# EAGLE board PulseRain_M10 (EAGLE 7.7.0)
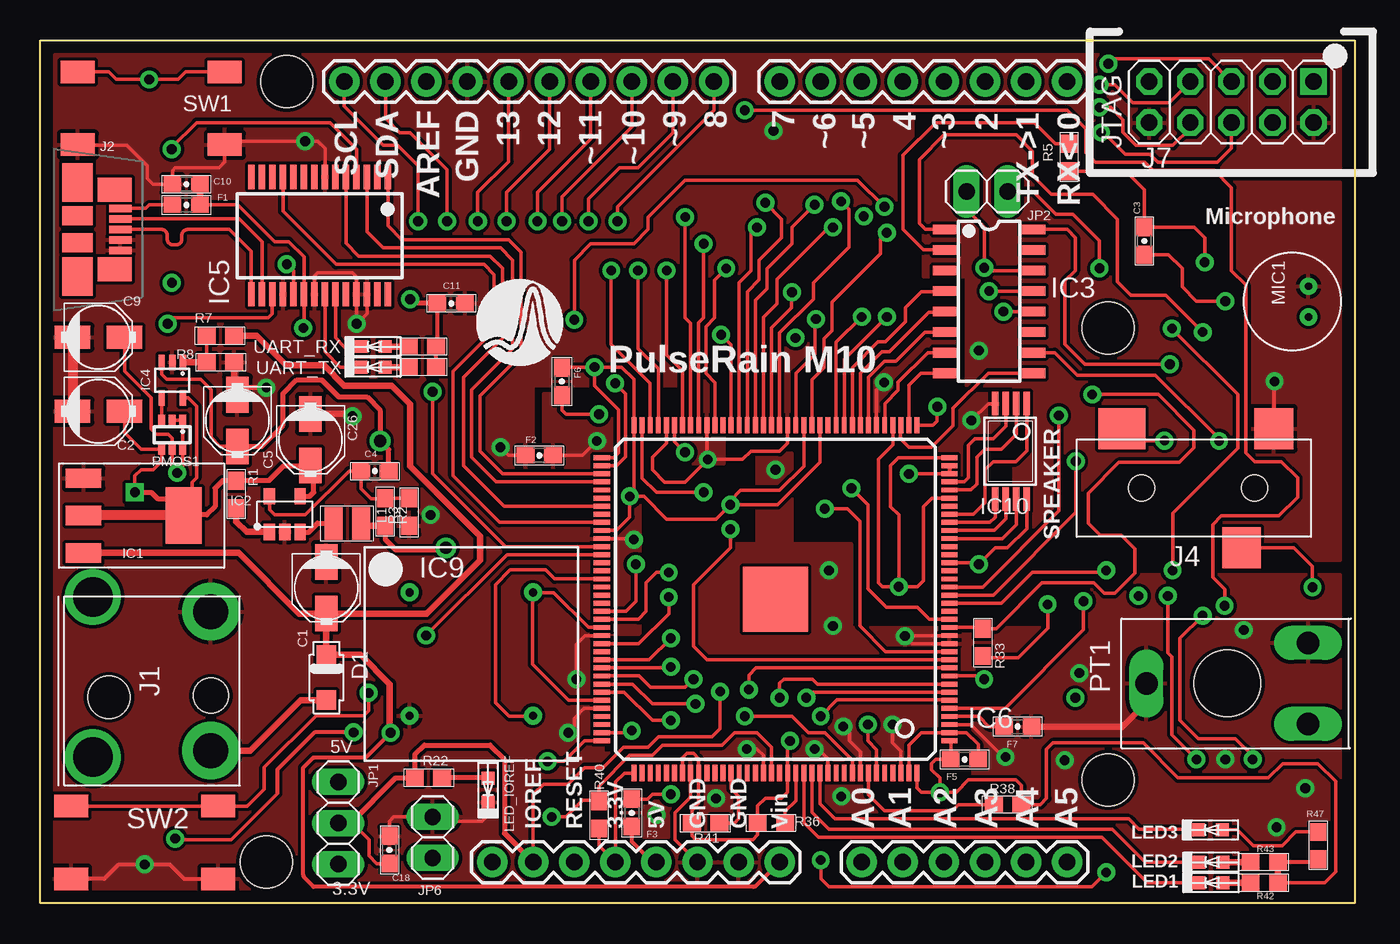
[diagram p14: board, top side]
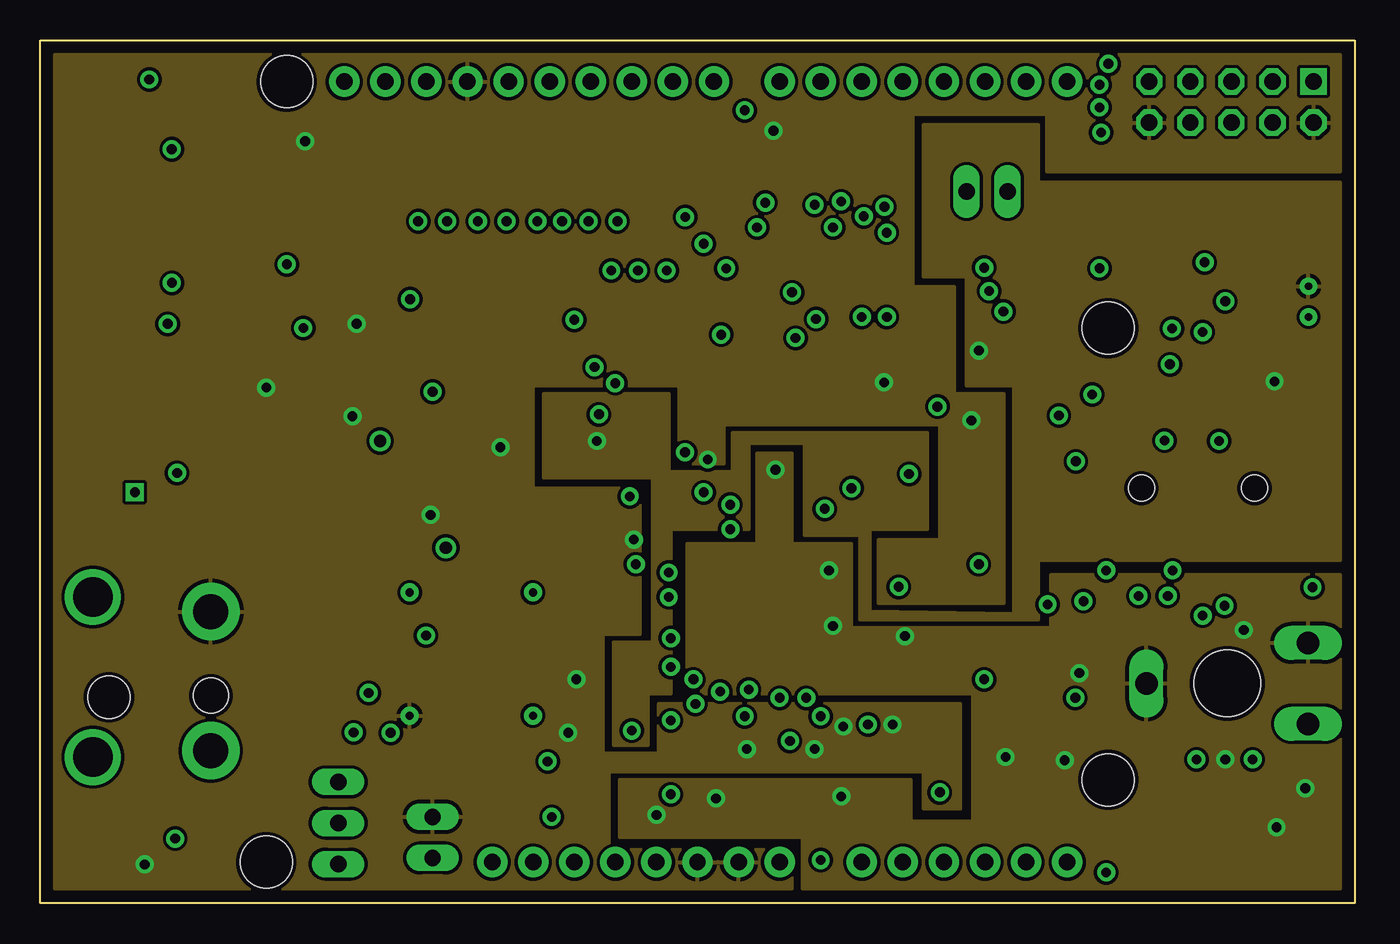
[diagram p15: board, inner layer Ground]
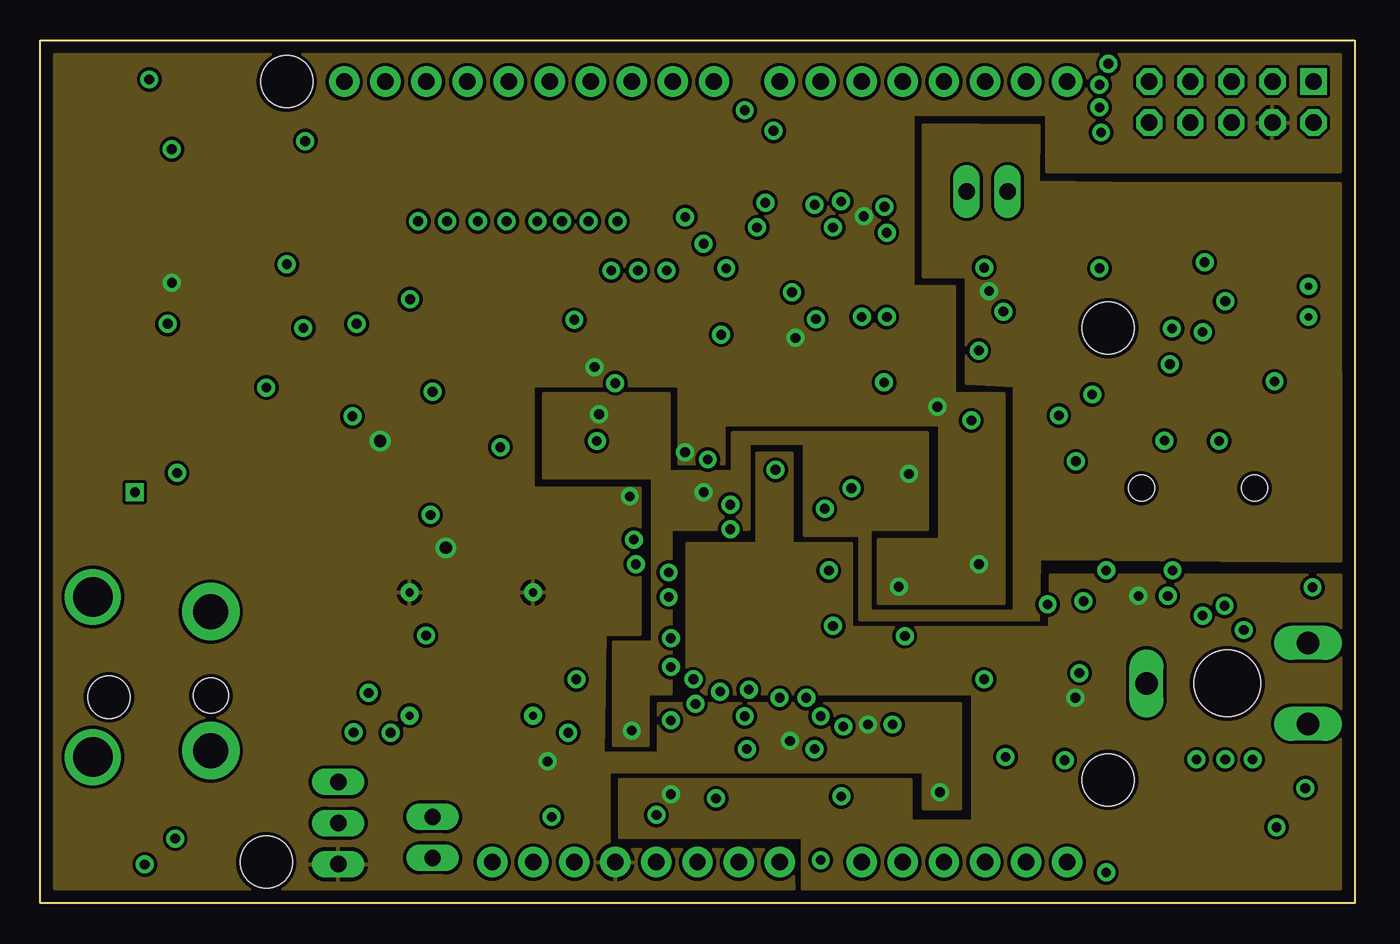
[diagram p16: board, inner layer Power]
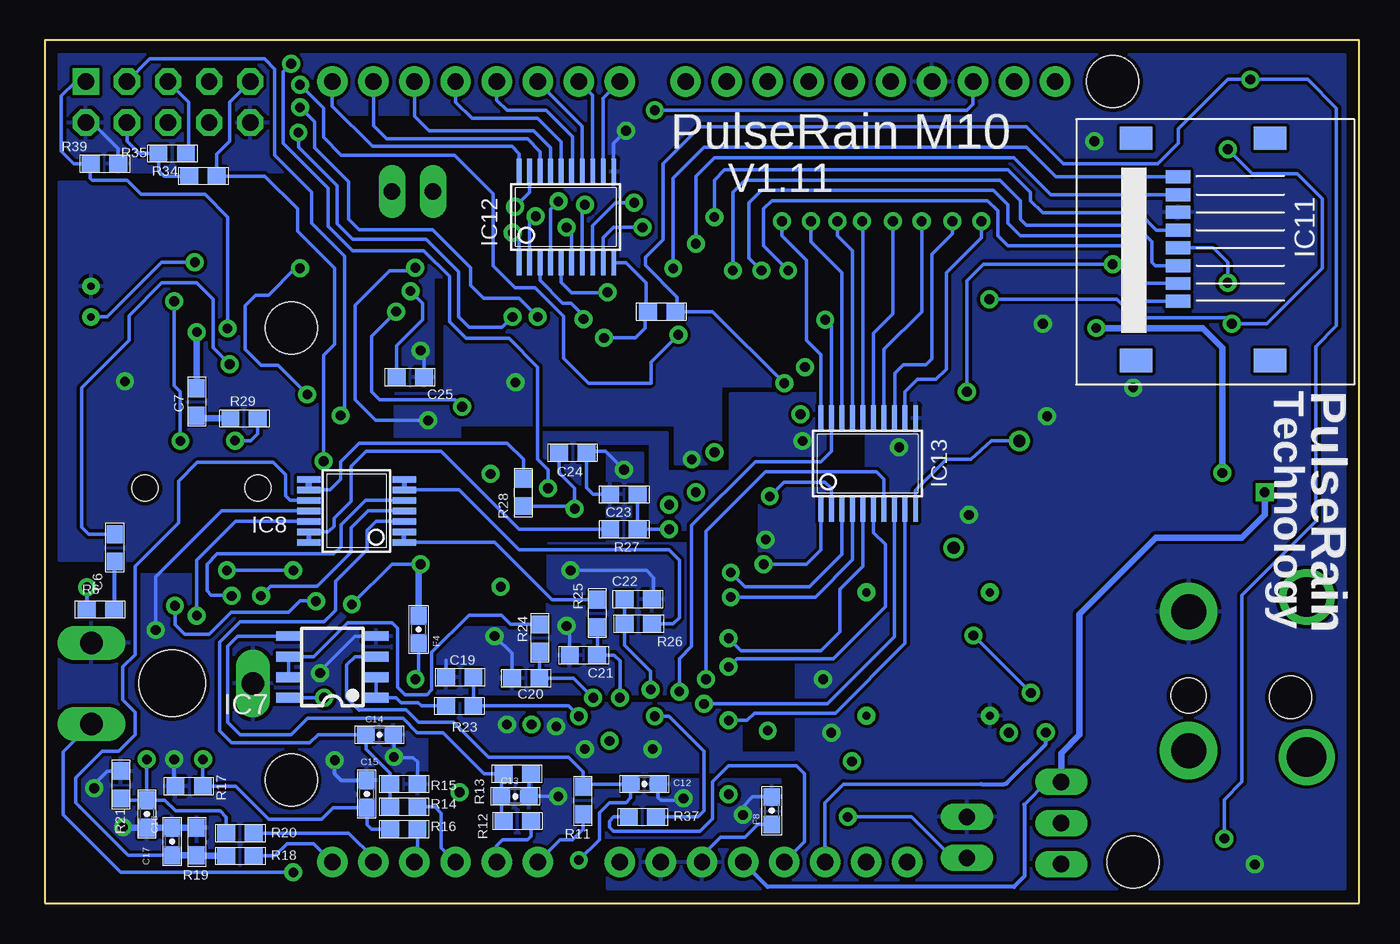
[diagram p17: board, bottom side, seen from below]

Size 81.28 x 53.34 mm. Coordinates in mm from the lower left corner, seen from the top.
Copper layers (1+2*15+16): Top 0.035mm / dielectric 0.1658625mm / Ground 0.035mm / dielectric 1.103mm / Power 0.035mm / dielectric 0.1658625mm / Bottom 0.035mm
Design rules "PulseRain_default *": minimum track width 8mil, minimum drill 10mil, track to track 8mil, track to pad 8mil, pad to pad 7.5mil, via to via 7.5mil, smd to smd 7.5mil, copper to edge 10mil, drill to drill 8mil, minimum pad ring 12mil, minimum via ring 10mil, stop-mask expansion 4mil, vias tented up to drill 25mil, thermal gap 10mil
Net classes: 0 default: width 0.203 mm, clearance 0.191 mm; 1 supply: width 0.203 mm, clearance 0.191 mm; 2 diff: width 0.203 mm, clearance 0.191 mm

## Footprints (pad centres in the part's own frame; a part is rotated, then mirrored left to right if it is on the bottom)
PANASONIC_B = smd 2.2 x 1.4: + 1.6,0; - -1.6,0
0603-CAP = smd 1.1 x 1: 1 -0.85,0; 2 0.85,0
VISHAY-R-0603 = smd 1.103 x 1: P$1 0.848,0; P$2 -0.848,0
SOD123W = smd 1.2 x 1.2: 1 1.4,0; 2 -1.4,0
0603-BEAD = smd 1.1 x 1: 1 -0.85,0; 2 0.85,0
SOT223 = smd 1.194 x 2.21: 1 -2.311,-3.099; 2 0,-3.099; 3 2.311,-3.099 | smd 3.505 x 2.21: VOUT 0,3.099
TSOT25 = smd 0.7 x 1: 1 -0.95,-1.1; 2 0,-1.1; 3 0.95,-1.1; 4 0.95,1.1; 5 -0.95,1.1
SOIC-16 = smd 0.6 x 1.55: 1 -4.445,-2.7; 2 -3.175,-2.7; 3 -1.905,-2.7; 4 -0.635,-2.7; 5 0.635,-2.7; 6 1.905,-2.7; 7 3.175,-2.7; 8 4.445,-2.7; 9 4.445,2.7; 10 3.175,2.7; 11 1.905,2.7; 12 0.635,2.7; 13 -0.635,2.7; 14 -1.905,2.7; 15 -3.175,2.7; 16 -4.445,2.7
SC-70-5 = smd 0.4 x 0.95: 1 -0.65,-1.1; 2 0,-1.1; 3 0.65,-1.1; 4 0.65,1.1; 5 -0.65,1.1
SSOP28 = smd 0.4 x 1.5: 1 -4.225,-3.625; 2 -3.575,-3.625; 3 -2.925,-3.625; 4 -2.275,-3.625; 5 -1.625,-3.625; 6 -0.975,-3.625; 7 -0.325,-3.625; 8 0.325,-3.625; 9 0.975,-3.625; 10 1.625,-3.625; 11 2.275,-3.625; 12 2.925,-3.625; 13 3.575,-3.625; 14 4.225,-3.625; 15 4.225,3.625; 16 3.575,3.625; 17 2.925,3.625; 18 2.275,3.625; 19 1.625,3.625; 20 0.975,3.625; 21 0.325,3.625; 22 -0.325,3.625; 23 -0.975,3.625; 24 -1.625,3.625; 25 -2.275,3.625; 26 -2.925,3.625; 27 -3.575,3.625; 28 -4.225,3.625
EQFP144 = smd 1 x 0.3: 1 -10.75,8.75; 2 -10.75,8.25; 3 -10.75,7.75; 4 -10.75,7.25; 5 -10.75,6.75; 6 -10.75,6.25; 7 -10.75,5.75; 8 -10.75,5.25; 9 -10.75,4.75; 10 -10.75,4.25; 11 -10.75,3.75; 12 -10.75,3.25; 13 -10.75,2.75; 14 -10.75,2.25; 15 -10.75,1.75; 16 -10.75,1.25; 17 -10.75,0.75; 18 -10.75,0.25; 19 -10.75,-0.25; 20 -10.75,-0.75; 21 -10.75,-1.25; 22 -10.75,-1.75; 23 -10.75,-2.25; 24 -10.75,-2.75; 25 -10.75,-3.25; 26 -10.75,-3.75; 27 -10.75,-4.25; 28 -10.75,-4.75; 29 -10.75,-5.25; 30 -10.75,-5.75; 31 -10.75,-6.25; 32 -10.75,-6.75; 33 -10.75,-7.25; 34 -10.75,-7.75; 35 -10.75,-8.25; 36 -10.75,-8.75; 73 10.75,-8.75; 74 10.75,-8.25; 75 10.75,-7.75; 76 10.75,-7.25; 77 10.75,-6.75; 78 10.75,-6.25; 79 10.75,-5.75; 80 10.75,-5.25; 81 10.75,-4.75; 82 10.75,-4.25; 83 10.75,-3.75; 84 10.75,-3.25; 85 10.75,-2.75; 86 10.75,-2.25; 87 10.75,-1.75; 88 10.75,-1.25; 89 10.75,-0.75; 90 10.75,-0.25; 91 10.75,0.25; 92 10.75,0.75; 93 10.75,1.25; 94 10.75,1.75; 95 10.75,2.25; 96 10.75,2.75; 97 10.75,3.25; 98 10.75,3.75; 99 10.75,4.25; 100 10.75,4.75; 101 10.75,5.25; 102 10.75,5.75; 103 10.75,6.25; 104 10.75,6.75; 105 10.75,7.25; 106 10.75,7.75; 107 10.75,8.25; 108 10.75,8.75 | smd 0.3 x 1: 37 -8.75,-10.75; 38 -8.25,-10.75; 39 -7.75,-10.75; 40 -7.25,-10.75; 41 -6.75,-10.75; 42 -6.25,-10.75; 43 -5.75,-10.75; 44 -5.25,-10.75; 45 -4.75,-10.75; 46 -4.25,-10.75; 47 -3.75,-10.75; 48 -3.25,-10.75; 49 -2.75,-10.75; 50 -2.25,-10.75; 51 -1.75,-10.75; 52 -1.25,-10.75; 53 -0.75,-10.75; 54 -0.25,-10.75; 55 0.25,-10.75; 56 0.75,-10.75; 57 1.25,-10.75; 58 1.75,-10.75; 59 2.25,-10.75; 60 2.75,-10.75; 61 3.25,-10.75; 62 3.75,-10.75; 63 4.25,-10.75; 64 4.75,-10.75; 65 5.25,-10.75; 66 5.75,-10.75; 67 6.25,-10.75; 68 6.75,-10.75; 69 7.25,-10.75; 70 7.75,-10.75; 71 8.25,-10.75; 72 8.75,-10.75; 109 8.75,10.75; 110 8.25,10.75; 111 7.75,10.75; 112 7.25,10.75; 113 6.75,10.75; 114 6.25,10.75; 115 5.75,10.75; 116 5.25,10.75; 117 4.75,10.75; 118 4.25,10.75; 119 3.75,10.75; 120 3.25,10.75; 121 2.75,10.75; 122 2.25,10.75; 123 1.75,10.75; 124 1.25,10.75; 125 0.75,10.75; 126 0.25,10.75; 127 -0.25,10.75; 128 -0.75,10.75; 129 -1.25,10.75; 130 -1.75,10.75; 131 -2.25,10.75; 132 -2.75,10.75; 133 -3.25,10.75; 134 -3.75,10.75; 135 -4.25,10.75; 136 -4.75,10.75; 137 -5.25,10.75; 138 -5.75,10.75; 139 -6.25,10.75; 140 -6.75,10.75; 141 -7.25,10.75; 142 -7.75,10.75; 143 -8.25,10.75; 144 -8.75,10.75 | smd 4 x 4: E 0,0
SOIC-SN-8 = smd 0.6 x 1.55: 1 -1.905,-2.7; 2 -0.635,-2.7; 3 0.635,-2.7; 4 1.905,-2.7; 5 1.905,2.7; 6 0.635,2.7; 7 -0.635,2.7; 8 -1.905,2.7
TSSOP-ST-14 = smd 0.4 x 1.45: 1 -1.95,-2.95; 2 -1.3,-2.95; 3 -0.65,-2.95; 4 0,-2.95; 5 0.65,-2.95; 6 1.3,-2.95; 7 1.95,-2.95; 8 1.95,2.95; 9 1.3,2.95; 10 0.65,2.95; 11 0,2.95; 12 -0.65,2.95; 13 -1.3,2.95; 14 -1.95,2.95
ACHL-DIP = drill 0.5: 1 -3.81,3.81; 4 -3.81,-3.81; 5 3.81,-3.81; 8 3.81,3.81
TSSOP-ST-8 = smd 0.4 x 1.45: 1 -1.95,-2.95; 2 -1.3,-2.95; 3 -0.65,-2.95; 4 0,-2.95; 5 0,2.95; 6 -0.65,2.95; 7 -1.3,2.95; 8 -1.95,2.95
MOLEX-0472192001 = smd 0.8 x 1.5: 1 3.3,0; 2 2.2,0; 3 1.1,0; 4 0,0; 5 -1.1,0; 6 -2.2,0; 7 -3.3,0; 8 -4.4,0 | smd 1.45 x 2: EP1 -6.78,5.7; EP2 -6.78,-2.6; EP3 6.97,-2.6; EP4 6.97,5.7
TSSOP8 = smd 0.3 x 1.6: 1 -2.925,-2.8; 2 -2.275,-2.8; 3 -1.625,-2.8; 4 -0.975,-2.8; 5 -0.325,-2.8; 6 0.325,-2.8; 7 0.975,-2.8; 8 1.625,-2.8; 9 2.275,-2.8; 10 2.925,-2.8; 11 2.925,2.8; 12 2.275,2.8; 13 1.625,2.8; 14 0.975,2.8; 15 0.325,2.8; 16 -0.325,2.8; 17 -0.975,2.8; 18 -1.625,2.8; 19 -2.275,2.8; 20 -2.925,2.8
PJ-051A = drill 2.16 pad 3.556: 1 -3.4,0; 2 5.2,0 | drill 2.44 pad 3.3: A 6.1,7.3; C -3.8,7.3 | hole 2.6: -0.1,6.3 | hole 2.16: 0,0
SD-47346-001 = smd 1.38 x 0.45: 1 2.66,1.3; 2 2.66,0.65; 3 2.66,0; 4 2.66,-0.65; 5 2.66,-1.3 | smd 1.9 x 2.375: EP1 0,2.913; EP4 0,-2.913 | smd 1.9 x 1.175: EP2 0,0.838; EP3 0,-0.838 | smd 2.1 x 1.475: EP5 2.3,-2.462; EP6 2.3,2.462
PHONE_JACK_NOT_SWITCHED = smd 2.4 x 2.55: 1 0.8,3.675; 5 -1.2,-3.675 | smd 2.9 x 2.55: 4 8.2,-3.675 | hole 1.6: 0,0; 7,0
2X05 = drill 1.016 square: 1 -5.08,-1.27 | drill 1.016 octagon: 2 -5.08,1.27; 3 -2.54,-1.27; 4 -2.54,1.27; 5 0,-1.27; 6 0,1.27; 7 2.54,-1.27; 8 2.54,1.27; 9 5.08,-1.27; 10 5.08,1.27
DUINO_IO_HEADER_10 = drill 1.016 pad 1.88: 8 22.606,0; 9 20.066,0; 10 17.526,0; 11 14.986,0; 12 12.446,0; 13 9.906,0; AREF 4.826,0; GND 7.366,0; SCL -0.254,0; SDA 2.286,0
DUINO_IO_HEADER_8 = drill 1.016 pad 1.88: 0 17.78,0; 1 15.24,0; 2 12.7,0; 3 10.16,0; 4 7.62,0; 5 5.08,0; 6 2.54,0; 7 0,0
DUINO_PWR_HEADER_8 = drill 1.016 pad 1.88: 3.3V 7.62,0; 5V 10.16,0; GND. 15.24,0; GND.. 12.7,0; I/OREF 2.54,0; N/C 0,0; RESET 5.08,0; VIN 17.78,0
DUINO_ANALOG_HEADER_6 = drill 1.016 pad 1.88: A0 0,0; A1 2.54,0; A2 5.08,0; A3 7.62,0; A4 10.16,0; A5 12.7,0
1X03 = drill 1.016 long: 1 -2.54,0; 2 0,0; 3 2.54,0
1X02 = drill 1.016 long: 1 -1.27,0; 2 1.27,0
DFE252012C = smd 1.1 x 2: 1 0.85,0; 2 -0.85,0
HARVATEK_0603 = smd 0.8 x 0.8: A -0.75,0; C 0.75,0
CMC-5044PF-A = drill 0.45: 1 -1,-0.95; 2 -1,0.95
SC70-6L = smd 0.41 x 0.65: 1 -0.65,-0.9; 2 0,-0.9; 3 0.65,-0.9; 4 0.65,0.9; 5 -0.65,0.9; 6 0,0.9
PT10LV10 = drill 1.4 long: 1A -2.5,-5; 1E 2.5,-5; 1S 0,5 | hole 4.1: 0,0
TE-2-1437565-8 = smd 1.4 x 2.1: 1 2.25,4.55; 2 2.25,-4.55; 3 -2.25,4.55; 4 -2.25,-4.55
DUINO = hole 3.2: 66.04,7.62; 66.04,35.56; 15.24,50.8; 13.97,2.54

## Placement (x,y rotation side)
C1  22u  [PANASONIC_B]  17.68,19.5 270 top
C2  22u  [PANASONIC_B]  3.59,30.41 0 top
C3  0.1u  [0603-CAP]  68.27,40.95 90 top
C4  22p  [0603-CAP]  20.69,26.71 180 top
C5  22u  [PANASONIC_B]  12.18,29.84 270 top
C6  1u  [VISHAY-R-0603]  76.96,21.97 90 bottom
C7  1u  [VISHAY-R-0603]  71.88,30.99 90 bottom
C9  22u  [PANASONIC_B]  3.59,34.99 0 top
C10  0.1u  [0603-CAP]  9.02,44.45 180 top
C11  0.1u  [0603-CAP]  25.4,37.08 0 top
C12  1p  [0603-CAP]  44.2,7.37 0 bottom
C13  1p  [0603-CAP]  52.2,6.6 0 bottom
C14  1p  [0603-CAP]  60.58,10.41 0 bottom
C15  1p  [0603-CAP]  61.38,6.76 90 bottom
C16  1p  [0603-CAP]  73.41,3.81 90 bottom
C17  1p  [0603-CAP]  74.97,5.51 270 bottom
C18  0.1u  [0603-CAP]  21.59,3.3 90 top
C19  1000p  [VISHAY-R-0603]  55.63,13.97 0 bottom
C20  1000p  [VISHAY-R-0603]  51.55,13.9 0 bottom
C21  1000p  [VISHAY-R-0603]  47.97,15.34 0 bottom
C22  1000p  [VISHAY-R-0603]  44.58,18.8 180 bottom
C23  1000p  [VISHAY-R-0603]  45.47,25.27 0 bottom
C24  1000p  [VISHAY-R-0603]  48.62,27.86 180 bottom
C25  1u  [VISHAY-R-0603]  58.67,32.51 180 bottom
C26  22u  [PANASONIC_B]  16.7,28.65 270 top
D1  PMEG3020ER  [SOD123W]  17.7,13.95 90 top
F1  BLM18PG121SZ1D  [0603-BEAD]  9.02,43.18 0 top
F2  BLM18PG121SZ1D  [0603-BEAD]  30.86,27.69 0 top
F3  BLM18PG121SZ1D  [0603-BEAD]  36.58,5.59 270 top
F4  BLM18PG121SZ1D  [0603-BEAD]  58.17,16.93 270 bottom
F5  BLM18PG121SZ1D  [0603-BEAD]  57.15,8.89 0 top
F6  BLM18PG121SZ1D  [0603-BEAD]  32.26,32.26 270 top
F7  BLM18PG121SZ1D  [0603-BEAD]  60.45,10.92 180 top
F8  BLM18PG121SZ1D  [0603-BEAD]  36.32,5.71 90 bottom
GND  PULSERAIN_LOGO_BIGGER  [PULSERAIN_LOGO_BIGGER]  26.92,33.15 0 top
IC1  AZ1117IH-5.0TRG1  [SOT223]  5.77,23.96 270 top
IC2  AP3429A  [TSOT25]  15.11,24.05 0 top
IC3  SI3000  [SOIC-16]  58.67,37.21 270 top
IC4  MCP6241UT-E/LT  [SC-70-5]  8.15,32.34 180 top
IC5  FT232RL  [SSOP28]  17.27,41.27 180 top
IC6  MAX10M08SAE144  [EQFP144]  45.47,18.8 180 top
IC7  MCP6242T-E/SN  [SOIC-SN-8]  63.5,14.61 90 bottom
IC8  MCP6244T-E/ST  [TSSOP-ST-14]  62.01,24.26 90 bottom
IC9  12MHz  [ACHL-DIP]  26.65,15.4 0 top
IC10  SRAM  [TSSOP-ST-8]  59.05,27.94 180 top
IC11  0472192001  [MOLEX-0472192001]  11.2,40.51 270 bottom
IC12  TXS0108EPWR  [TSSOP8]  49.02,42.42 0 bottom
IC13  TXS0108EPWR  [TSSOP8]  30.35,27.18 0 bottom
J1  PJ-051A  [PJ-051A]  10.54,12.83 90 top
J2  MICRO-USB-B  [SD-47346-001]  2.29,41.66 0 top
J4  PHONE_JACK_NOT_SWITCHED  [PHONE_JACK_NOT_SWITCHED]  75.09,25.65 180 top
J7  ALTERA_JTAG  [2X05]  73.66,49.53 180 top
J8  DUINO_IO_HEADER_10  [DUINO_IO_HEADER_10]  19.05,50.8 0 top
J9  DUINO_HEADER_8  [DUINO_IO_HEADER_8]  45.72,50.8 0 top
J10  DUINO_HEADER_8  [DUINO_PWR_HEADER_8]  27.94,2.54 0 top
J11  DUINO_ANALOG_HEADER_6  [DUINO_ANALOG_HEADER_6]  50.8,2.54 0 top
JP1  IOREF JUMPER  [1X03]  18.41,4.95 270 top
JP2  DNI  [1X02]  58.55,44 180 top
JP6  BOOT IMAGE SELECT  [1X02]  24.26,4.06 90 top
L1  2.2u  [DFE252012C]  18.98,23.47 180 top
LED1  GREEN  [HARVATEK_0603]  72.39,1.27 180 top
LED2  RED  [HARVATEK_0603]  72.39,2.54 180 top
LED3  BLUE  [HARVATEK_0603]  72.36,4.53 180 top
LED_IOREF  BLUE  [HARVATEK_0603]  27.69,6.99 270 top
MIC1  MIC-CUICMC-5044PF-A  [CMC-5044PF-A]  77.43,37.2 180 top
PMOS1  PMOS_SQ1421EDH  [SC70-6L]  8.15,28.96 180 top
PT1  200k  [PT10LV10]  73.41,13.59 90 top
R1  10k  [VISHAY-R-0603]  12.11,25.27 90 top
R2  226k, 1%  [VISHAY-R-0603]  21.33,24.18 90 top
R3  49.9k, 1%  [VISHAY-R-0603]  22.8,24.18 270 top
R5  2.2k  [VISHAY-R-0603]  63.63,46.1 90 top
R6  30  [VISHAY-R-0603]  77.85,18.16 180 bottom
R7  10k  [VISHAY-R-0603]  11.13,35.09 180 top
R8  10k  [VISHAY-R-0603]  11.13,33.44 0 top
R9  330  [VISHAY-R-0603]  23.62,34.42 180 top
R10  330  [VISHAY-R-0603]  23.62,33.15 180 top
R11  100k  [VISHAY-R-0603]  48.01,6.35 270 bottom
R12  100k  [VISHAY-R-0603]  52.07,5.08 0 bottom
R13  200k  [VISHAY-R-0603]  52.07,8 180 bottom
R14  100k  [VISHAY-R-0603]  59.09,5.97 0 bottom
R15  200k  [VISHAY-R-0603]  59.09,7.37 0 bottom
R16  100k  [VISHAY-R-0603]  59.09,4.57 0 bottom
R17  200k  [VISHAY-R-0603]  72.36,7.23 180 bottom
R18  100k  [VISHAY-R-0603]  69.22,2.92 0 bottom
R19  200k  [VISHAY-R-0603]  71.88,3.81 270 bottom
R20  100k  [VISHAY-R-0603]  69.22,4.32 0 bottom
R21  200k  [VISHAY-R-0603]  76.58,7.32 90 bottom
R22  330  [VISHAY-R-0603]  24,7.75 0 top
R23  100  [VISHAY-R-0603]  55.63,12.19 180 bottom
R24  100  [VISHAY-R-0603]  50.67,16.38 90 bottom
R25  100  [VISHAY-R-0603]  47.12,17.91 90 bottom
R26  100  [VISHAY-R-0603]  44.58,17.27 0 bottom
R27  100  [VISHAY-R-0603]  45.47,23.11 0 bottom
R28  100  [VISHAY-R-0603]  51.69,25.4 270 bottom
R29  30  [VISHAY-R-0603]  68.96,29.97 0 bottom
R32  DNI  [VISHAY-R-0603]  43.13,36.56 180 bottom
R33  10k  [VISHAY-R-0603]  58.29,16.13 270 top
R34  10k  [VISHAY-R-0603]  71.5,44.96 0 bottom
R35  10k  [VISHAY-R-0603]  73.41,46.35 0 bottom
R36  10k  [VISHAY-R-0603]  45.21,4.95 180 top
R37  10k  [VISHAY-R-0603]  44.32,5.33 0 bottom
R38  10k  [VISHAY-R-0603]  59.82,6.1 180 top
R39  1k  [VISHAY-R-0603]  77.6,45.72 0 bottom
R40  10k  [VISHAY-R-0603]  34.54,5.46 270 top
R41  10k  [VISHAY-R-0603]  41.14,4.94 180 top
R42  330  [VISHAY-R-0603]  75.69,1.27 180 top
R43  330  [VISHAY-R-0603]  75.69,2.54 180 top
R47  330  [VISHAY-R-0603]  79.03,3.56 90 top
SW1  TE-2-1437565-8  [TE-2-1437565-8]  6.86,49.15 90 top
SW2  TE-2-1437565-8  [TE-2-1437565-8]  6.45,3.75 90 top
U$8  DUINO  [DUINO]  0,0 0 top
UART_RX  RED  [HARVATEK_0603]  20.57,34.42 180 top
UART_TX  GREEN  [HARVATEK_0603]  20.57,33.15 180 top

## Tracks (layer width: path | path; a pad name or v marks a point on that pad's centre or on a via)
3V3_FLT  (via drill 0.6)
  Top 0.203: IC6.107 36.45,10.55 v36.58,10.67 | v41.02,25.4 38.1,25.4 37.22,26.28 IC6.71 | IC3.13 v58.67,37.85 | IC6.35 | IC6.34 v53.72,26.55 v53.72,26.54 | F6.2 32.26,30.48 32.51,30.23 v34.54,30.23
  Top 0.254: IC6.35 IC6.34
  Bottom 0.203: v58.67,37.85 57.91,37.08 57.91,36.07 59.52,34.46 C25.P$1
  pour Power: 31.11,31.5 38.86,31.5 38.86,26.67 42.8,26.67 42.8,29.08 54.86,29.08 54.86,23.11 51.31,23.11 51.31,18.03 60.23,18.03 60.23,32 57.28,32.13 57.28,38.73 54.61,38.73 54.61,48.13 61.76,48.07 61.73,44.57 68.56,44.49 80.4,44.48 80.41,21.15 61.77,21.28 61.73,17.53 50.67,17.53 50.67,22.73 47.24,22.73 47.24,28.45 43.81,28.45 43.81,23.11 38.99,23.11 38.99,12.95 37.59,12.95 37.59,9.78 35.43,9.78 35.43,16.13 37.85,16.13 37.85,26.29 31.11,26.29
3V3_PIN0_RX  (via drill 0.6)
  Top 0.203: v52.34,41.45 51.94,41.05 51.94,40.15 48.95,37.15 48.95,35.4 48.45,34.9 48.45,33.1 47.72,32.37 IC6.50
  Bottom 0.203: IC12.1 51.94,41.05 v52.34,41.45
3V3_PIN1_TX  (via drill 0.6)
  Top 0.203: IC6.52 46.72,32.77 47.9,33.95 47.9,36.05 v47.97,36.12 v47.97,36.13
  Bottom 0.203: IC12.3 50.65,38.5 49.25,37.1 48.75,37.1 47.97,36.32 v47.97,36.12
3V3_PIN2  (via drill 0.6)
  Top 0.203: IC6.54 45.72,29.59 45.72,35.27 47.8,37.35 47.8,38.35 50,40.55 50,42.92 v49.52,43.39
  Bottom 0.203: IC12.4 50,42.92 v49.52,43.39
3V3_PIN3~  (via drill 0.6)
  Top 0.203: IC6.55 45.22,35.57 46.45,36.8 46.45,37.74 v46.48,37.77
  Bottom 0.203: IC12.5 49.35,38.4 48.7,37.75 46.5,37.75 v46.48,37.77
3V3_PIN4  (via drill 0.6)
  Top 0.203: v49.02,41.78 48.77,41.78 45.55,38.56 45.55,37.05 44.72,36.22 IC6.56
  Bottom 0.203: IC12.6 48.7,41.46 v49.02,41.78
3V3_PIN5~  (via drill 0.6)
  Top 0.203: v47.88,43.18 46.48,41.78 46.48,40.77 44.95,39.23 44.95,38 44.22,37.27 IC6.57
  Bottom 0.203: IC12.7 48.05,43.01 v47.88,43.18
3V3_PIN6~  (via drill 0.6)
  Top 0.203: v44.83,43.31 45.85,42.29 45.85,41.15 44.45,39.75 44.45,38.55 43.72,37.82 IC6.58
  Bottom 0.203: IC12.8 47.4,41.88 45.97,43.31 v44.83,43.31
3V3_PIN7  (via drill 0.6)
  Top 0.203: IC6.59 43.22,38.37 43.95,39.1 43.95,41.41 v44.32,41.78
  Bottom 0.203: IC12.9 46.75,41.14 46.1,41.78 v44.32,41.78
3V3_PIN8  (via drill 0.6)
  Top 0.203: IC6.92 36.21,18.05 36.83,18.67 v36.83,20.95
  Bottom 0.203: IC13.1 33.28,21.84 34.16,20.95 v36.83,20.95
3V3_PIN9~  (via drill 0.6)
  Top 0.203: v38.86,20.45 38.1,20.45 37.47,19.81 37.47,18.03 36.98,17.55 IC6.93
  Bottom 0.203: IC13.3 31.98,21.56 33.98,19.56 37.97,19.56 v38.86,20.45
3V3_PIN10~  (via drill 0.6)
  Top 0.203: v38.86,18.92 38.86,17.91 37,16.05 IC6.96
  Bottom 0.203: IC13.4 31.33,21.22 33.63,18.92 v38.86,18.92
3V3_PIN11~  (via drill 0.6)
  Top 0.203: IC6.98 37.65,15.05 v38.99,16.38
  Bottom 0.203: 38.86,16.26 v38.99,16.38 38.23,15.62 33.27,15.62 32.1,16.8 32.1,19.4 30.68,20.82 IC13.5
3V3_PIN12  (via drill 0.6)
  Top 0.203: IC6.99 38.93,14.55 v38.99,14.61
  Bottom 0.203: IC13.6 30.03,22.92 29.3,22.19 29.3,18.32 32.51,15.11 38.48,15.11 v38.99,14.61
3V3_PIN13  (via drill 0.6)
  Top 0.203: v40.39,13.84 39.88,13.34 37.72,13.34 37.01,14.05 IC6.100
  Bottom 0.203: v40.39,13.84 40.39,22.99 36.7,26.67 29.84,26.67 29.38,26.2 IC13.7
3V3_SCL  (via drill 0.6)
  Top 0.203: IC6.102 36.1,13.05 37.85,11.3 v38.99,11.3
  Bottom 0.203: v38.99,11.3 37.85,11.3 37.4,11.75 32.4,11.75 28.08,16.07 IC13.9
3V3_SDA  (via drill 0.6)
  Top 0.203: IC6.101 36.62,13.55 37.85,12.32 v40.51,12.32
  Bottom 0.203: v40.51,12.32 32.89,12.32 28.73,16.48 IC13.8
5V_FLT  (via drill 0.6)
  Top 0.203: F3.1 37.55,6.44 37.85,6.73 v38.99,6.73
  Bottom 0.203: IC8.4 61.29,24.26 62.35,23.2 62.35,21.7 64.45,19.6 67.31,19.6 v67.91,19 | IC7.8 v64.01,12.7
  pour Power: 35.81,7.62 53.85,7.62 53.85,5.08 57.66,5.08 57.66,12.95 40.01,12.95 40.01,22.23 44.32,22.23 44.32,27.81 46.48,27.81 46.48,22.23 50.16,22.23 50.16,17.02 62.43,17.02 62.48,20.26 80.44,20.26 80.39,0.89 47.12,0.89 47.12,4.06 35.81,4.06
+3V3  (via drill 0.6, 0.76)
  Top 0.203: v36.45,25.15 36.72,25.41 IC6.72 36.72,32.38 35.95,33.15 v34.27,33.15 | IC6.82 35.62,23.05 36.45,23.88 v36.45,25.15 | v46.35,10.03 46.22,9.89 IC6.128 46.22,6.85 45.85,6.48 44.83,6.48 44.36,6.01 R36.P$1 44.36,4.23 44.07,3.94 40.51,3.94 40.3,4.16 R41.P$1 40.3,5.75 40.72,6.17 IC6.117 40.72,8.94 40.39,9.27 40.01,9.27 39.72,8.98 IC6.115 | v31.37,8.76 32.38,8.76 33.67,10.05 IC6.108 | IC6.49 48.22,27.26 45.59,24.64 v42.67,24.64 | IC6.51 47.22,27.02 45.72,25.53 43.31,25.53 42.67,24.89 v42.67,24.64 | IC6.31 55.15,25.05 54.61,24.51 54.61,19.94 54.23,19.56 v53.09,19.56 | IC3.12 v59.56,36.58 | IC6.36 53.07,27.55 52.58,27.05 52.58,24.51 53.09,24 v53.09,19.56 | IC6.40 52.72,28.33 51.82,27.43 51.82,19.81 52.07,19.56 v53.09,19.56 | IC6.23 57.95,21.05 v58.04,20.95 59.05,21.97 59.82,21.97 61.01,23.16 IC10.8 | IC6.139 51.72,9.5 51.18,10.03 v51.18,11.05 | 54.23,8.03 IC6.144 54.22,7.12 54.48,6.86 v55.63,6.86 | IC6.1 56.23,10.03 56.26,10.03 56.3,9.99 F5.1 55.37,8.89 55.12,8.64 55.12,8.26 55.63,7.75 v55.63,6.86 | v55.63,6.86 56.64,6.86 57.4,7.62 60.33,7.62 60.66,7.28 R38.P$2 61.85,6.1 62.23,6.48 62.23,9.53 62.61,9.91 68.2,9.91 70.36,7.75 75.95,7.75 76.83,8.64 78.99,8.64 80.1,7.53 80.1,1.95 79.42,1.27 R42.P$2 | IC6.109 36.11,8.05 35.56,7.49 J10.3.3V 34.54,3.56 R40.P$1 | F6.1 32.3,33.15 v34.27,33.15 | IC6.103 32.67,12.55 30.45,14.76 IC9.8 31.75,19.2 33.9,17.05 IC6.94 | v42.67,24.64 41.78,23.75 38.73,23.75 37.34,25.15 v36.45,25.15 | IC4.3 7.5,32.7 7.8,32.4 9.9,32.4 10.55,31.75 10.55,28.8 11.1,28.25 C5.+ | v62.3,18.47 62.3,17 60.48,15.18 58.4,15.18 R33.P$1 | IC6.37 55.2,29.55 55.45,29.8 55.45,30.67 v55.48,30.7
  Top 0.203: IC6.67 39.22,28.53 v39.87,27.88 | IC6.73 35.45,27.55 35.75,27.85 35.75,30.5 34.27,31.98 v34.27,33.15
  Top 0.254: R47.P$2 78.86,2.54 R43.P$2
  Top 0.305: R2.P$2 21.33,22.49 21.97,21.84 24.95,21.84 v25.07,21.97
  Top 0.32: C5.+ 13.69,28.24 15,29.55 15,31.5 15.85,32.35 17.4,32.35 18.45,31.3 20.2,31.3 21.01,30.49 v21.01,28.57 21.54,28.05 C4.1
  Top 0.406: R42.P$2 R43.P$2 | R2.P$2 19.96,23.34 L1.2
  Bottom 0.203: IC12.10 46.08,39.6 45.35,39.6 44.1,38.35 44.1,36.55 R32.P$1 44.15,36.5 44.15,35.55 44.75,34.95 v46.7,34.95 | IC13.10 27.43,25.53 25.53,27.43 24,27.43 22.73,28.57 v21.01,28.57 | IC13.2 32.63,25.64 33.02,26.04 35.56,26.04 v36.45,25.15 | J7.4 76.2,47.12 75.44,46.35 R35.P$2 74.25,45.3 73.91,44.96 R34.P$2 | J10.3.3V 34.29,3.81 34.29,8 34.8,8.51 38.99,8.51 40.01,7.49 40.01,5.21 40.77,4.45 46.1,4.45 46.35,4.7 46.35,5.08 46.1,5.33 R37.P$2 | v59.56,36.58 61.09,35.05 61.09,31.62 60.58,31.11 55.9,31.11 v55.48,30.7 | v58.04,20.95 59.81,20.95 v62.3,18.47 | IC12.2 51.3,42.09 v50.92,42.47 | IC11.4 9.02,40.51 8.13,39.62 v8.13,38.35
  Bottom 0.406: F4.1 58.17,20.83 v58.04,20.95
  pour Power: 0.89,52.45 80.39,52.45 80.39,45.21 62.26,45.21 62.26,48.77 53.98,48.77 53.98,38.1 56.52,38.1 56.52,31.5 59.6,31.5 59.6,18.54 51.82,18.54 51.82,22.48 55.63,22.48 55.63,29.59 42.29,29.59 42.29,27.18 39.5,27.18 39.5,32 30.48,32 30.48,25.65 37.08,25.65 37.08,16.64 34.92,16.64 34.8,9.27 38.23,9.27 38.23,12.32 56.9,12.32 56.9,5.84 54.61,5.84 54.61,8.13 35.18,8.13 35.18,3.3 46.48,3.3 46.61,0.89 0.89,0.89
+5V  (via drill 0.6)
  Top 0.203: C2.+ 5.21,30.39 5.21,29.08 6.23,28.06 PMOS1.4 7.5,27.31 6.99,26.8 6.22,26.8 5.84,26.42 v5.84,25.4 | IC1.2 2.67,24 | IC4.5 9.15,31.24 9.65,30.73 9.65,26.29 9.4,26.04 9.4,24.49 IC1.VOUT
  Top 0.254: J10.5V 37.85,2.54 36.58,3.81 F3.2
  Top 0.305: R1.P$1 11.26,26.12 10.79,25.65 10.79,24.51 10.29,24 8.91,24 IC1.VOUT 8.76,24.07 8.76,24.89 8.64,25.02 7.24,25.02 6.86,25.4 v5.84,25.4
  Top 0.32: IC2.4 16.65,25.15 16.9,25.4 16.9,26.85 C26.+ 15.05,27.05 14.12,26.12 R1.P$1
  Top 0.61: 2.67,24 8.83,24 IC1.VOUT
  Bottom 0.203: 20.7,6.1 19.3,7.49 JP1.1
  Bottom 0.254: 20.7,6.1 20.7,1.65 21.34,1.02 36.58,1.02 J10.5V
  Bottom 0.406: JP1.1 18.41,9.29 17.3,10.4 17.3,17.88 12.57,22.61 7.24,22.61 5.84,24 v5.84,25.4
A0
  Bottom 0.203: J11.A0 49.4,3.94 48.64,3.94 48.01,4.57 R11.P$1
A1
  Bottom 0.203: J11.A1 53.34,3.56 52.96,3.94 51.44,3.94 51.22,4.15 R12.P$1
A2
  Bottom 0.203: J11.A2 56.77,3.43 56.77,5.57 57.15,5.95 58.12,5.95 R14.P$1
A3
  Bottom 0.203: J11.A3 58.24,2.72 R16.P$1
A4
  Bottom 0.203: J11.A4 60.96,2.79 62.48,4.32 R20.P$1
A5
  Bottom 0.203: J11.A5 64.64,3.68 66.29,3.68 67.06,2.92 R18.P$1
ADC_IN0
  Bottom 0.203: IC7.2 IC7.1 59.55,12.7 59.25,12.4 58.2,12.4 57.99,12.19 R23.P$1
ADC_IN1
  Bottom 0.203: IC7.7 IC7.6 64.66,15.24 62.55,17.35 59.8,17.35 59.45,17 59.45,13.35 59,12.9 57.65,12.9 57.35,13.2 57.35,15.5 55.05,17.8 53.05,17.8 52.48,17.23 R24.P$1
ADC_IN2
  Bottom 0.203: IC8.1 53.48,22.31 49.92,18.75 R25.P$1
  Bottom 0.305: IC8.1 IC8.2
ADC_IN3
  Bottom 0.203: IC8.6 55.66,25.56 51.94,21.84 42.67,21.84 42.04,21.21 42.04,17.65 42.42,17.27 R26.P$1
  Bottom 0.305: IC8.7 IC8.6
ADC_IN4
  Bottom 0.203: IC8.13 63.75,22.95 63.4,23.3 63.4,23.8 62.35,24.85 62.35,27 61.41,27.94 56.77,27.94 51.94,23.11 R27.P$2
  Bottom 0.305: IC8.13 IC8.14
ADC_IN5
  Bottom 0.203: IC8.9 63.65,25.55 63,26.2 63,27.3 61.85,28.45 52.7,28.45 51.69,27.43 R28.P$2
  Bottom 0.406: IC8.9 IC8.8
AGND_CODEC  (via drill 0.6)
  Top 0.203: F2.2 33.53,27.69 v34.42,28.57
  Top 0.254: J4.5 76.33,29.33 v76.33,32.26
  Bottom 0.203: C25.P$2 57.83,33.95 v58.04,34.16
  pour Ground: 31.11,31.5 38.86,31.5 38.86,26.67 42.8,26.67 42.8,29.08 54.86,29.08 54.86,23.11 51.31,23.11 51.31,18.03 60.2,17.91 60.2,32 57.28,32 57.28,38.73 54.61,38.73 54.61,48.13 61.72,48.13 61.72,44.58 80.39,44.58 80.39,21.21 61.72,21.21 61.72,17.53 50.67,17.53 50.67,22.73 47.24,22.73 47.24,28.45 43.81,28.45 43.81,23.11 38.99,23.11 38.99,12.95 37.59,12.95 37.59,9.78 35.43,9.78 35.43,16.13 37.85,16.13 37.85,26.29 31.11,26.29
  pour Bottom: 61.72,21.21 80.39,21.21 80.39,44.58 61.72,44.58 61.72,48.13 54.61,48.13 54.61,38.73 57.28,38.73 57.28,32 60.2,32 60.2,17.91 51.31,17.91 51.31,23.11 54.86,23.11 54.86,29.08 42.8,29.08 42.8,26.67 38.86,26.67 38.86,31.5 31.11,31.5 31.11,26.29 37.85,26.29 37.85,16.13 35.43,16.13 35.43,9.78 37.59,9.78 37.59,12.95 38.99,12.95 38.99,23.11 43.81,23.11 43.81,28.45 47.24,28.45 47.24,22.73 50.67,22.73 50.67,17.53 61.72,17.53
  pour Top: 47.24,22.73 50.67,22.73 50.67,17.53 61.72,17.53 61.72,21.21 80.39,21.21 80.39,44.58 61.72,44.58 61.72,48.13 54.61,48.13 54.61,38.73 57.28,38.73 57.28,32 60.2,32 60.2,17.91 51.31,17.91 51.31,23.11 54.86,23.11 54.86,29.08 42.8,29.08 42.8,26.67 38.86,26.67 38.86,31.5 31.11,31.5 31.11,26.29 37.85,26.29 37.85,16.13 35.43,16.13 35.43,9.78 37.59,9.78 37.59,12.95 38.99,12.95 38.99,23.11 43.81,23.11 43.81,28.45 47.24,28.45
AGND_FPGA  (via drill 0.6)
  Top 0.203: IC6.3 57.53,11.05 59.54,9.04 v59.69,9.04 | IC6.14 53.5,16.55 v53.47,16.51 53.93,16.05 IC6.13
  Top 0.406: F7.1 66.93,10.92 68.33,12.32 68.33,13.51 PT1.1S
  Bottom 0.203: 43.31,7.33 C12.2 43.35,6.52 43.18,6.35 41.91,6.35 v41.78,6.48 | IC7.4 62.1,16.51 64.26,14.35 v64.26,14.22 | v49.53,6.6 C13.2 51.35,7.88 R13.P$2 | C14.2 59.69,10.38 v59.69,9.04 59.65,9 58.5,9 58.24,8.74 R15.P$1 | C16.2 73.41,4.7 73.34,4.76 | C17.2 | v49.02,17.14 48.82,16.94 C21.P$2 | v45.47,26.8 46.61,27.94 47.69,27.94 C24.P$2 47.78,25.68 47.37,25.27 C23.P$2 | R21.P$1 77.43,8.17 78.23,7.37 v78.23,7.11 | v48.77,20.57 44.07,20.57 43.63,20.13 43.63,18.8 | 56.47,15.03 C19.P$2 | C20.P$2 52.4,15.44 v53.47,16.51 | IC8.11 70.36,24.26 74.42,20.19 v74.42,16.89 | v38.1,5.46 38.1,5.97 37.5,6.57 F8.2
  Bottom 0.254: v63.35,8.84 63.35,8 62.96,7.61 C15.2 | R17.P$1 73.28,7.3 v73.28,8.89
  Bottom 0.406: C16.2 C17.2 75,4.66 | 73.34,4.76 73.24,4.66 R19.P$2 | C17.2 75,4.66 | 75,4.66 75,4.65 | 75,4.65 76.45,4.65 v76.45,4.7 | 75,4.65 74.99,4.66
  pour Ground: 35.81,4.06 47.12,4.06 47.12,0.89 80.39,0.89 80.39,20.32 62.48,20.32 62.48,17.02 50.16,17.02 50.16,22.23 46.48,22.23 46.48,27.81 44.32,27.81 44.32,22.23 40.01,22.23 40.01,12.95 57.66,12.95 57.66,5.08 53.85,5.08 53.85,7.62 35.81,7.62
  pour Top: 50.16,22.23 50.16,17.02 62.48,17.02 62.48,20.32 80.39,20.32 80.39,0.89 47.12,0.89 47.12,4.06 35.81,4.06 35.81,7.62 53.85,7.62 53.85,5.08 57.66,5.08 57.66,12.95 40.01,12.95 40.01,22.23 44.32,22.23 44.32,27.81 46.48,27.81 46.48,22.23
  pour Bottom: 44.32,22.23 44.32,27.81 46.48,27.81 46.48,22.23 50.16,22.23 50.2,17.02 62.48,17.02 62.48,20.32 80.39,20.32 80.39,0.89 47.12,0.89 47.12,4.06 35.81,4.06 35.81,7.62 53.85,7.62 53.85,5.08 57.66,5.08 57.66,12.95 40.01,12.95 40.01,22.23
AREF  (via drill 0.6)
  Top 0.203: IC6.5 59.67,12.05 64.52,16.89 v64.52,18.67 | v43.56,49.02 63.5,49.02 64.65,47.87 64.65,46.4 65.25,45.8 68.3,45.8 68.8,45.3 72.6,45.3 73.66,44.24 73.66,39.12 74.55,38.23 74.55,27.85 75.1,27.3 76.75,27.3 77.75,26.3 77.75,25.1 76.6,23.95 73.05,23.95 72.5,23.4 72.5,20.15 73.25,19.4 v73.25,18.4 v73.24,18.39
  Bottom 0.203: v43.56,49.02 24.26,49.02 23.88,49.4 J8.AREF | v64.52,18.67 64.55,18.7 65.5,18.7 66.2,18 69.76,18 71.12,16.64 72.64,16.64 73.24,17.23 v73.24,18.39
CODEC_FSYNC_N
  Top 0.203: IC6.43 51.22,32.52 52.2,33.5 52.9,33.5 54.7,35.3 IC3.6
CODEC_MCLK
  Top 0.203: IC3.7 54.89,34.04 53.05,32.2 53.05,31.7 52.22,30.87 IC6.41
CODEC_RESET_N
  Top 0.203: IC3.9 58.62,32.77 56.45,30.6 56.45,29.53 55.12,28.19 53.71,28.19 53.2,28.7 53.2,29.53 IC6.39
CODEC_SCLK
  Top 0.203: IC3.8 54.47,32.77 53.72,32.02 IC6.38
CODEC_SDI
  Top 0.203: IC6.45 50.22,33.12 51.8,34.7 52.25,34.7 53.5,35.95 53.5,36.8 54.5,37.8 55.93,37.8 IC3.4
CODEC_SDO
  Top 0.203: IC6.44 50.72,32.77 52.05,34.1 52.5,34.1 54.95,36.55 55.95,36.55 IC3.5
FT232R_CTS_N
  Top 0.203: IC6.81 28.4,23.55 25.53,26.42 25.53,32.89 28.07,35.43 28.07,38.86 27.43,39.5 18.29,39.5 15,42.79 IC5.11
FT232R_RESET_N  (via drill 0.61)
  Top 0.203: IC5.19 15.65,39.09 v15.24,39.5 | v24.26,31.62 24.26,26.54 28.75,22.05 IC6.84
  Bottom 0.203: v15.24,39.5 23.24,39.5 24.26,38.48 v24.26,31.62
FT232R_RTS_N
  Top 0.203: IC5.3 20.2,41.52 21.21,40.51 28.45,40.51 29.21,39.75 29.21,34.29 26.67,31.75 26.67,27.56 28.18,26.05 IC6.76
FT232R_RXD
  Top 0.203: IC5.5 18.9,40.79 19.68,40.01 27.81,40.01 28.57,39.24 28.57,34.92 26.16,32.51 26.16,27.05 28.67,24.55 IC6.79
FT232R_RXLED_N
  Top 0.203: IC5.22 17.6,34.09 18.54,33.15 UART_TX.C
FT232R_TXD
  Top 0.203: IC5.1 21.5,41.88 22.35,41.02 28.96,41.02 29.72,40.26 29.72,33.91 27.18,31.37 27.18,27.94 28.57,26.55 IC6.75
FT232R_TXLED_N
  Top 0.203: IC5.23 18.25,34.97 18.8,34.42 UART_RX.C
GND  (via drill 0.6, 0.61)
  Top 0.203: IC6.116 40.22,6.56 39.24,5.59 39.24,3.94 J10.GND.. | IC5.26 20.2,36.45 v19.56,35.81 19.55,35.83 IC5.25 19.56,37.66 19.56,38.73 19.3,38.99 17.14,38.99 16.95,38.79 IC5.21 | IC5.7 17.6,46.66 17.14,47.12 v16.38,47.12 11.63,47.12 SW1.4 11.41,45.83 11.05,45.47 8.35,45.47 8.16,45.28 C10.2 | C10.2 8.26,44.45 | SW1.3 2.34,46.86 5.33,46.86 6.6,45.59 6.6,44.83 6.99,44.45 C10.2 | IC6.137 50.72,9.36 50.04,10.03 50.04,10.54 v49.66,10.92 | IC6.125 44.72,9.13 44.32,9.53 v43.69,9.53 | IC6.104 33.64,12.05 33.02,11.43 33.02,10.92 v32.64,10.54 | IC6.142 53.21,9.4 52.7,9.91 v52.7,11.05 | IC6.133 48.72,8.94 48.13,9.53 v47.88,9.53 | IC6.63 41.22,27.49 v41.27,27.43 | IC6.53 46.22,28.44 45.72,27.94 43.94,27.94 43.43,27.43 v41.27,27.43 | v41.27,27.43 39.88,26.04 38.61,26.04 37.85,26.8 37.85,27.56 38.72,28.43 IC6.68 | LED_IOREF.C 27.69,5.46 27.3,5.08 24.51,5.08 JP6.2 21.84,5.33 21.59,5.08 C18.2 | IC6.95 33.69,16.55 33.15,16 v33.15,13.84 | IC6.83 36.64,22.55 v36.7,22.48 | IC10.4 58.62,30.89 v57.57,29.84 | IC6.42 51.72,31.73 v52.18,32.2 | IC3.14 58.55,39.12 v58.37,39.29 58.37,41.78 57.35,42.8 57.35,43.93 JP2.2 | v28.45,28.19 28.96,27.69 F2.1
  Top 0.254: SW2.3 3.95,1.5 4.85,2.4 v6.45,2.4 8,2.4 8.9,1.5 SW2.4
  Top 0.305: v13.97,31.88 12.18,31.88 C5.-
  Top 0.406: C26.- 19.3,30.25 v19.3,30.1 | C5.- 11.98,31.64 R8.P$1
  Top 0.61: C9.- C2.-
  Bottom 0.203: J7.2 78.36,48.26 76.75,46.65 R39.P$1 | IC12.11 46.1,46.99 v45.34,47.75 | J10.GND.. 40.64,2.92 39.5,4.06 37.97,4.06 37.17,4.87 F8.1 | v57.57,29.84 60.83,29.84 62.1,31.11 62.1,36.96 59.95,39.12 58.55,39.12 v58.37,39.29
  other vias: 24.13,24
  pour Ground: 0.89,52.45 80.39,52.45 80.39,45.21 62.26,45.21 62.26,48.77 53.98,48.77 53.98,38.1 56.52,38.1 56.52,31.5 59.6,31.5 59.6,18.54 51.82,18.54 51.82,22.48 55.63,22.48 55.63,29.59 42.29,29.59 42.29,27.18 39.5,27.18 39.5,32 30.48,32 30.48,25.65 37.08,25.65 37.08,16.64 34.8,16.64 34.8,9.27 38.23,9.27 38.23,12.32 56.9,12.32 56.9,5.84 54.61,5.84 54.61,8.13 35.18,8.13 35.18,3.3 46.48,3.3 46.48,0.89 0.89,0.89
  pour Top: 30.48,32 39.5,32 39.5,27.18 42.29,27.18 42.29,29.59 55.63,29.59 55.63,22.48 51.82,22.48 51.82,18.41 59.6,18.41 59.6,31.5 56.52,31.5 56.52,38.1 53.98,38.1 53.98,48.77 62.28,48.72 62.28,45.17 80.39,45.21 80.39,52.45 0.89,52.45 0.89,0.89 46.48,0.89 46.48,3.3 35.18,3.3 35.18,8.13 54.61,8.13 54.61,5.84 56.9,5.84 56.9,12.32 38.23,12.32 38.23,9.27 34.8,9.27 34.8,16.64 37.08,16.64 37.08,25.65 30.48,25.65
  pour Bottom: 30.48,32 39.5,32 39.5,27.18 42.29,27.18 42.29,29.59 55.63,29.59 55.63,22.48 51.82,22.48 51.82,18.67 59.6,18.67 59.6,31.5 56.52,31.5 56.52,38.1 53.98,38.1 53.98,48.77 63.88,48.77 63.88,45.21 80.39,45.21 80.39,52.45 0.89,52.45 0.89,0.89 46.48,0.89 46.48,3.3 35.18,3.3 35.18,8.13 54.61,8.13 54.61,5.84 56.9,5.84 56.9,12.32 38.23,12.32 38.23,9.27 34.8,9.27 34.8,16.64 37.08,16.64 37.08,25.65 30.48,25.65
IOREF  (via drill 0.6)
  Top 0.203: 30.48,2.67 30.61,2.67 | v42.04,13.08 42.04,10.79 41.53,10.29 38.23,10.29 37.59,9.65 36.07,9.65 34.8,8.38 33.66,8.38 32.64,7.37 31.11,7.37 30.48,6.73 J10.I/OREF | v52.2,43.05 50.55,44.7 39.88,44.7 37.59,42.42 37.59,41.66 36.7,40.77 34.04,40.77 33.02,39.75 v33.02,36.07 | C18.1 20.79,2.45 20.32,2.92 20.32,3.94 19.3,4.95 JP1.2
  Top 0.305: 30.48,2.67 30.35,2.54 J10.I/OREF 28.7,4.32 28.7,8.89 27.81,9.78 23.75,9.78 23.16,9.19 R22.P$2 21.97,7.75 19.18,4.95 JP1.2
  Top 1.016: J10.I/OREF 30.48,2.67
  Bottom 0.203: v42.04,13.08 42.04,15.11 41.27,15.88 41.27,23.37 37.34,27.3 33.27,27.3 32.63,27.95 IC13.19 32.63,35.68 v33.02,36.07 | IC12.19 51.3,43.95 v52.2,43.05
JTAG_PIN6  (via drill 0.6)
  Top 0.203: J7.6 73.66,46.66 72.8,45.8 69.1,45.8 68.6,46.3 67.1,46.3 65.75,47.65 v65.6,47.65 | IC6.46 49.72,33.62 v52.35,36.25
  Bottom 0.203: v65.6,47.65 65.6,46.75 63.2,44.35 63.2,42 62.25,41.05 57.7,41.05 55.7,39.05 55.7,36.25 55.05,35.6 53,35.6 v52.35,36.25
JTAG_PIN7  (via drill 0.6)
  Top 0.203: IC6.60 42.72,34.53 v42.1,35.15 | J7.7 69.82,49.5 67.55,49.5 66.45,50.6 v65.5,50.6
  Bottom 0.203: v65.5,50.6 64.05,49.15 64.05,47.35 62.95,46.25 55.95,46.25 53.55,43.85 53.55,39.4 52.2,38.05 50.95,38.05 49.2,36.3 49.2,33.7 47.65,32.15 43.8,32.15 43.8,33.45 v42.1,35.15
JTAG_PIN8  (via drill 0.6)
  Top 0.203: J7.8 71.12,47.92 70.05,46.85 67.75,46.85 66.95,47.65 66.95,48.45 66.2,49.2 v65.5,49.2 | IC6.47 49.22,34.67 v50.8,36.25
  Bottom 0.203: v50.8,36.25 51.95,37.4 54.15,37.4 54.95,38.2 54.95,39.3 57.3,41.65 61.85,41.65 62.5,42.3 62.5,44.6 64.6,46.7 64.6,48.3 v65.5,49.2
JTAGEN  (via drill 0.6)
  Top 0.203: v65.5,39.25 65.5,40.95 63.85,42.6 62.8,42.6 61.4,44 JP2.1 | v65.05,31.45 69.15,31.45 71.35,29.25 71.35,28.15 70.45,27.25 66.7,27.25 64.8,25.35 64.8,23.5 65.55,22.75 66.85,22.75 67.7,21.9 67.7,20.4 66.45,19.15 65.8,19.15 65.15,19.8 61.95,19.8 59.13,16.98 R33.P$2 58.22,17.05 IC6.15
  Bottom 0.203: v65.5,39.25 65.8,39.25 67.45,37.6 68.25,37.6 68.9,36.95 68.9,34.25 67.9,33.25 66.85,33.25 v65.05,31.45
MICRO_SD_CD_DAT3  (via drill 0.6)
  Top 0.203: IC6.69 38.22,33.03 36.96,34.29 v36.96,39.12
  Bottom 0.203: v36.96,39.12 37.72,39.88 37.72,43.31 36.96,44.07 22.61,44.07 21.72,43.18 21.72,42.04 20.95,41.27 14.35,41.27 13.46,40.39 13.46,38.48 13.29,38.31 IC11.2
MICRO_SD_CLK  (via drill 0.6)
  Top 0.203: IC6.65 40.22,35.86 39.88,36.2 v39.88,42.42
  Bottom 0.203: v39.88,42.42 39.88,44.7 39.24,45.34 21.72,45.34 20.32,43.94 20.32,43.43 19.56,42.67 13.59,42.67 12.53,41.61 IC11.5
MICRO_SD_CMD  (via drill 0.6)
  Top 0.203: IC6.66 39.72,32.93 38.73,33.91 v38.73,39.12
  Bottom 0.203: v38.73,39.12 38.73,43.94 37.97,44.7 22.23,44.7 20.95,43.43 20.95,42.29 20.57,41.91 13.84,41.91 12.83,40.89 12.83,39.62 12.62,39.41 IC11.3
MICRO_SD_DAT0  (via drill 0.6)
  Top 0.203: IC6.64 40.72,35.89 41.02,36.2 v41.02,40.77
  Bottom 0.203: v41.02,40.77 41.02,44.96 39.88,46.1 21.34,46.1 19.05,43.81 IC11.7
MICRO_SD_DAT1  (via drill 0.6)
  Top 0.203: IC6.62 41.72,32.18 41.15,32.75 41.15,35.65 41.7,36.2 41.7,38.52 v42.42,39.24
  Bottom 0.203: v42.42,39.24 42.42,44.83 40.51,46.74 20.57,46.74 18.75,44.91 IC11.8
MICRO_SD_DAT2  (via drill 0.6)
  Top 0.203: IC6.70 37.72,32.13 35.31,34.54 v35.31,39.12
  Bottom 0.203: v35.31,39.12 36.83,40.64 36.83,42.93 36.32,43.43 22.99,43.43 22.35,42.8 22.35,41.27 21.72,40.64 14.73,40.64 14.1,40.01 14.1,37.72 13.59,37.21 IC11.1
N$1
  Top 0.406: D1.2 16.11,12.55 12.98,9.43 J1.1
N$2
  Top 0.203: IC9.5 30.42,11.55 29,11.55 28.15,12.4 28.15,19.7 29.05,20.6 31.25,20.6 31.8,20.05 IC6.88
N$3
  Top 0.203: IC4.1 | R7.P$1 R8.P$2
  Top 0.406: IC4.1 R8.P$2
N$4
  Top 0.254: IC2.3 16.08,22.93
  Top 0.32: 16.08,22.93 16.58,22.93 17.14,23.5 18.11,23.5 L1.1
N$5
  Top 0.406: R1.P$2 12.11,23.59 12.75,22.95 IC2.1
N$6
  Top 0.203: IC2.5 14.16,24.32 14.48,24 16.38,24 19.09,26.71 C4.2 19.84,25.63 20.45,25.02 21.31,25.02 R2.P$1 R3.P$2
N$7
  Top 0.203: 8.14,42.96 F1.1 6.73,43.18 6.51,42.96 J2.1
N$8  (via drill 0.6)
  Top 0.203: IC3.10 62.74,34.04 64.14,32.64 68.96,32.64 72.9,28.7 v72.9,28.57 | C3.1 69.76,40.1 70.61,39.24 70.61,38.1 71.5,37.21 v73.28,37.21
  Bottom 0.203: v73.28,37.21 73.28,32 72.9,31.62 v72.9,28.57
N$9  (via drill 0.6)
  Top 0.203: IC3.16 63.5,41.66 64.01,41.15 64.01,39.12 63.37,38.48 63.37,34.54 64.6,33.32 v69.85,33.32
  Bottom 0.203: v69.85,33.32 70.87,34.33 70.87,37.34 71.88,38.35 74.04,38.35 76.07,36.32 76.07,34.8 78.99,31.88 78.99,23.24 78.57,22.82 C6.P$1
N$10  (via drill 0.6)
  Top 0.203: R5.P$2 63.63,45.15 63.73,45.25 67.14,45.25 68.27,44.12 C3.2 71.36,41.8 72.01,41.15 v72.01,39.62
  Bottom 0.203: MIC1.2 77.42,36.24 74.04,39.62 v72.01,39.62
N$11
  Top 0.203: IC6.132 48.22,6.14 49.15,5.21 67.31,5.21 67.94,4.57 71.61,4.57 LED3.C
N$12
  Top 0.203: IC4.4 PMOS1.3
N$13  (via drill 0.6)
  Top 0.203: v20.3,13 20.3,11.9 20,11.6 17.05,11.6 13.85,8.4 13.85,7.05 12.8,6 SW2.2 SW2.1 | v23.85,16.55 28.85,21.55 IC6.85
  Bottom 0.203: v20.3,13 v23.85,16.55
N$14  (via drill 0.6)
  Top 0.203: IC6.11 41.22,15.05 40.39,15.88 40.39,19.68 42.67,21.97 v42.67,23.11
  Bottom 0.203: C23.P$1 R27.P$1 v42.66,23.11 v42.67,23.11
N$15  (via drill 0.61)
  Top 0.203: 14.35,37.59 14.35,37.6 IC5.17 14.35,36.45 14.1,36.2 8.26,36.2 v7.87,35.81 | IC5.4 19.55,46.62 17.91,48.26 9.65,48.26 8.13,46.74 v8.13,46.61
  Top 0.254: R10.P$2 R9.P$2 24.55,34.5 C11.1
  Top 0.305: C11.1 23.11,37.08 v22.86,37.34
  Bottom 0.203: v8.13,46.61 6.6,45.09 3.81,45.09 2.29,43.56 2.29,39.24 5.71,35.81 v7.87,35.81 8.26,36.2 13.84,36.2 14.99,37.34 v22.86,37.34
N$16
  Top 0.406: UART_RX.A R9.P$1
N$17
  Top 0.406: UART_TX.A R10.P$1
N$18
  Top 0.305: LED_IOREF.A 27.67,7.75 R22.P$1
N$19
  Bottom 0.203: R12.P$2 53.05,5.21 C13.1 53.02,6.63 53.02,7.9 R13.P$1 54.1,8 56.65,10.55 58.25,10.55 59.13,11.43 65.02,11.43 66.04,10.41 69.22,10.41 69.98,11.18 69.98,15.88 69.34,16.51 IC7.5
N$20
  Bottom 0.203: IC8.10 66.11,24.91 66.4,25.2 66.4,26.5 67.15,27.25 71.85,27.25 73,26.1 73,23.52 75.69,20.83 75.69,15.37 76.45,14.61 76.45,12.57 75.69,11.81 75.69,10.41 76.71,9.4 77.72,9.4 79.38,7.75 79.38,6.22 76.11,2.96 C16.1 | 71.84,2.92 R19.P$1 | R18.P$2 70.06,2.94
  Bottom 0.406: R18.P$2 71.84,2.92 R19.P$1 71.89,2.95 73.38,2.95 73.39,2.96 C16.1
N$22
  Bottom 0.203: IC8.3 60.8,23.6 61.35,23.05 61.35,21.85 63.3,19.9 63.3,18.11 64.01,17.4 69.22,17.4 70.48,16.13 70.48,10.67 69.72,9.91 64.9,9.91 64.39,10.41 C14.1 | 61.4,10.38 C14.1 | R14.P$2 R15.P$2 59.94,8.02 61.42,9.51 C14.1
N$23  (via drill 0.6)
  Top 0.203: v69.72,19 69.72,15.49 69.98,15.24 69.98,10.41 v71.5,8.89
  Bottom 0.203: IC8.5 61.45,24.9 62.95,23.4 62.95,22.05 63.41,21.59 70.61,21.59 71.25,20.95 71.25,19.3 70.99,19.05 69.77,19.05 v69.72,19 | R16.P$2 61.07,4.57 61.35,4.85 61.35,5.88 C15.1 63.44,5.91 64.15,5.2 67.45,5.2 69.48,7.23 R17.P$2 | R17.P$2 | R17.P$2 v71.51,8.88 v71.5,8.89
N$24  (via drill 0.6)
  Top 0.203: IC6.6 56.36,12.55 56.39,12.57 49.28,12.57 v48.26,11.56
  Bottom 0.203: v48.26,11.56 48.9,12.19 R23.P$2 C19.P$1
N$25  (via drill 0.6)
  Top 0.203: IC6.7 47.72,13.05 v47.37,12.7
  Bottom 0.203: v47.37,12.7 48.57,13.9 C20.P$1 50.67,13.93 R24.P$2 50.71,15.49
N$26  (via drill 0.6)
  Top 0.203: IC6.8 48.05,13.55 47.75,13.84 45.97,13.84 45.72,13.59 v45.72,12.7
  Bottom 0.203: v45.72,12.7 45.72,14.99 46.07,15.34 C21.P$1 47.12,15.36 47.11,15.38 R25.P$2
N$27  (via drill 0.6)
  Top 0.203: v65.91,1.91 65.02,1.02 48.77,1.02 48.26,1.52 v48.26,2.67
  Bottom 0.203: v65.91,1.91 76.58,1.91 80.14,5.46 80.14,9.36 PT1.1A | IC7.3 62.1,15.24 62.61,14.73 62.61,12.7 61.85,11.94 61.84,11.95 58.95,11.95 58.18,11.18 56.01,11.18 53.85,9.02 48.9,9.02 48.01,8.13 R11.P$2 47.84,7.37 C12.1 45.05,6.52 45.34,6.22 46.35,6.22 46.99,5.59 46.99,3.94 v48.26,2.67
N$28  (via drill 0.6)
  Top 0.203: v71.88,17.78 70.48,16.38 70.48,11.3 71.63,10.16 73.91,10.16 74.97,9.1 v74.97,8.89
  Bottom 0.203: IC8.12 69.48,23.61 71.88,21.21 v71.88,17.78 | R20.P$2 70.06,5.31 70.45,5.7 73.2,5.7 73.86,6.36 C17.1 | R21.P$2 76.46,6.36 C17.1 | C17.1 v74.97,8.89
N$29  (via drill 0.6)
  Top 0.203: IC6.10 44.26,14.55 43.81,14.1 v43.81,13.21
  Bottom 0.203: v43.81,13.21 43.81,14.35 45.42,15.96 R26.P$2 C22.P$1
N$30  (via drill 0.6)
  Top 0.203: IC6.12 52.27,15.55 50.67,17.14 50.67,23.62 49.91,24.38 v48.51,24.38
  Bottom 0.203: v48.51,24.38 48.51,25.65 49.47,26.61 C24.P$1 | 48.58,24.45 v48.51,24.38 | R28.P$1 48.68,24.55 v48.51,24.38
N$34  (via drill 0.6)
  Top 0.203: IC6.9 58.16,14.05 v58.37,13.84
  Bottom 0.203: v58.37,13.84 v58.36,13.85 58.35,13.85 58.17,14.03 F4.2
N$36
  Top 0.203: IC3.2 54.61,40.39 53.34,41.66 53.34,46.23 55.37,48.26 61.47,48.26 62.78,46.95 R5.P$1
N$37  (via drill 0.6)
  Top 0.203: IC3.1 54.74,41.66 54.36,42.04 54.36,45.97 55.88,47.5 60.35,47.5 61.35,46.5 61.35,45 62.53,43.81 65.08,43.81 66.6,42.3 66.6,38.43 67.44,37.59 69.6,37.59 v71.88,35.31
  Bottom 0.406: v71.88,35.31 C7.P$1
N$39
  Bottom 0.203: 71.86,30.01 71.88,30.04 C7.P$2 71.71,29.97
  Bottom 0.406: 71.71,29.97 R29.P$2
N$40
  Top 0.203: IC6.143 53.72,9.01 53.72,9.02 53.72,9.78 54.49,10.55 IC6.2 57.27,10.55 58,9.82 F5.2
N$41
  Bottom 0.254: C6.P$2 77,21.08 R6.P$2
N$42  (via drill 0.6)
  Top 0.203: J4.1 77.52,21.98 78.68,20.82 v78.68,19.53
  Bottom 0.254: v78.68,19.53 78.7,19.51 R6.P$1
N$43  (via drill 0.6)
  Top 0.203: J4.4 67.62,28.6 v69.52,28.6
  Bottom 0.203: v69.52,28.6 68.55,28.6 68.11,29.04 R29.P$1
N$67
  Top 0.203: IC6.129 46.72,6.33 46.06,5.67 R36.P$2
N$68  (via drill 0.6)
  Top 0.203: v43.56,11.56 46.48,11.56 47.5,10.54 48.51,10.54 50.22,8.84 IC6.136
  Bottom 0.203: v43.56,11.56 42.67,11.56 40.51,9.4 40.51,5.71 40.89,5.33 R37.P$1
N$69
  Top 0.203: IC6.138 51.22,6.7 52.2,5.71 56.39,5.71 56.77,6.1 R38.P$1
N$70  (via drill 0.6)
  Top 0.203: IC6.126 45.21,9.65 44.32,10.54 42.93,10.54 42.16,9.78 38.48,9.78 37.85,9.14 36.45,9.14 34.54,7.24 R40.P$2 34.5,6.35 33.53,6.35 32.51,5.33 v31.62,5.33
  Bottom 0.203: v31.62,5.33 27.69,5.33 25.15,2.79 JP6.1
N$71
  Top 0.203: IC6.121 42.72,7.07 43.18,6.6 43.18,5.21 42.92,4.94 R41.P$2
N$72
  Top 0.203: LED1.C 68.45,1.27 65.66,4.06 48.13,4.06 47.22,4.98 IC6.130
N$73
  Top 0.203: IC6.131 47.72,5.62 48.77,4.57 66.29,4.57 68.33,2.54 LED2.C
N$77
  Top 0.406: LED1.A R42.P$1
N$78
  Top 0.406: LED2.A R43.P$1
N$83
  Top 0.203: LED3.A 74.02,4.53 75,3.55 76.8,3.55 77.65,4.4 R47.P$1
N$85
  Top 0.203: IC6.4 58.05,11.55 58.67,10.92 F7.2
PIN0_RX
  Bottom 0.203: J9.0 63.5,49.28 61.02,46.8 52.4,46.8 51.95,46.35 IC12.20
PIN1_TX
  Bottom 0.203: IC12.18 50.65,46.46 51.44,47.25 60.15,47.25 60.96,48.06 J9.1
PIN2
  Bottom 0.203: IC12.17 50,46.7 51.05,47.75 57.53,47.75 58.42,48.64 J9.2
PIN3~
  Bottom 0.203: IC12.16 49.35,47.06 50.8,48.51 54.86,48.51 55.88,49.53 J9.3
PIN4
  Bottom 0.203: IC12.15 48.7,45.28 48.64,45.34 48.64,47.37 50.29,49.02 52.7,49.02 53.34,49.66 J9.4
PIN5~
  Bottom 0.203: IC12.14 48.05,48.05 J9.5
PIN6~
  Bottom 0.203: IC12.13 47.4,49.94 J9.6
PIN7
  Bottom 0.203: IC12.12 46.75,49.77 J9.7
PIN8  (via drill 0.61)
  Top 0.203: v35.69,42.16 35.69,43.05 41.66,49.02 J8.8
  Bottom 0.203: v35.69,42.16 35.69,41.27 34.16,39.75 34.16,34.8 33.28,33.91 IC13.20
PIN9~  (via drill 0.61)
  Top 0.203: J8.9 39.12,47.62 36.96,45.47 35.81,45.47 33.91,43.56 v33.91,42.16
  Bottom 0.203: v33.91,42.16 33.91,40.89 31.98,38.96 IC13.18
PIN10~  (via drill 0.61)
  Top 0.203: v32.26,42.16 32.26,43.69 36.58,48.01 J8.10
  Bottom 0.203: IC13.17 31.33,40.34 32.26,41.27 v32.26,42.16
PIN11~  (via drill 0.61)
  Top 0.203: J8.11 34.04,47.24 30.73,43.94 v30.73,42.16
  Bottom 0.203: IC13.16 30.68,42.11 v30.73,42.16
PIN12  (via drill 0.61)
  Top 0.203: v28.83,42.16 28.83,43.94 31.5,46.61 J8.12
  Bottom 0.203: IC13.15 30.03,35.25 28.83,36.45 v28.83,42.16
PIN13  (via drill 0.61)
  Top 0.203: v27.05,42.16 27.05,43.94 28.96,45.85 J8.13
  Bottom 0.203: IC13.14 29.38,34.25 27.05,36.58 v27.05,42.16
RESET_N  (via drill 0.6)
  Top 0.203: IC6.74 35.65,27.05 36.2,27.6 36.2,31.5 v35.55,32.15 | SW1.1 4.23,51.4 4.7,50.93 v6.73,50.93 8.51,50.93 8.98,51.4 SW1.2 | 14.65,6.8 14.65,6.78 11.81,3.94 8.39,3.94 v8.34,3.99
  Top 0.254: v19.37,10.56 16.96,10.56 14.65,8.25 14.65,6.8
  Bottom 0.203: J10.RESET 33.02,6.22 31.88,7.37 23.37,7.37 | v35.55,32.15 39.98,36.58 42.17,36.58 | 42.17,36.58 R32.P$2 | 42.17,36.58 42.17,37.47 44.13,39.44 44.13,39.94 43.05,41.02 43.05,45.72 40.77,48.01 20.57,48.01 18.29,45.72 12.45,45.72 11.18,46.99 11.18,47.88 8.13,50.93 v6.73,50.93 3.17,50.93 1.4,49.15 1.4,35.69 2.67,34.42 2.67,23.62 7.24,19.05 7.24,7.49 8.34,6.4 v8.34,3.99
  Bottom 0.254: 23.37,7.37 21.95,7.37 arc-45 21.77,7.44 19.37,9.84 v19.37,10.56
SCL  (via drill 0.61)
  Top 0.203: v23.37,42.16 23.37,45.59 22.1,46.86 21.21,46.86 18.8,49.28 J8.SCL
  Bottom 0.203: IC13.12 28.08,31.61 27.3,32.38 26.16,32.38 25.53,33.02 25.53,38.99 23.37,41.15 v23.37,42.16
SDA  (via drill 0.61)
  Top 0.203: v25.15,42.16 25.15,45.34 22.86,47.62 22.23,47.62 21.34,48.51 J8.SDA
  Bottom 0.203: IC13.13 28.73,30.2 28.7,30.23 28.7,32.77 28.19,33.27 26.8,33.27 26.42,33.66 26.42,40.13 25.15,41.4 v25.15,42.16
SRAM_CS_N
  Top 0.203: IC6.29 57.7,24.05 58.42,24.77 58.42,26.8 58.93,27.3 60.33,27.3 61.01,27.98 IC10.1
SRAM_SCK
  Top 0.203: IC6.27 58.99,23.05 59.7,23.76 IC10.6
SRAM_SIO0
  Top 0.203: IC6.28 58.73,23.55 59.05,23.88 IC10.5
SRAM_SIO1
  Top 0.203: IC6.32 57.55,25.55 57.91,25.91 57.91,27.56 58.42,28.07 59.44,28.07 60.35,28.99 IC10.2
SRAM_SIO2
  Top 0.203: IC6.33 57.16,26.05 57.4,26.29 57.4,28.32 57.78,28.7 58.93,28.7 59.7,29.48 IC10.3
SRAM_SIO3
  Top 0.203: IC6.26 59.5,22.55 60.35,23.4 IC10.7
TCK  (via drill 0.6)
  Top 0.203: v65.91,20.57 65.79,20.45 61.34,20.45 59.44,18.55 IC6.18 | v69.99,35.53 74.04,31.48 74.04,28.14 70.02,24.12 v70.02,20.57
  Bottom 0.203: J7.1 79.38,50.8 80.26,49.91 80.26,46.48 79.5,45.72 R39.P$2 78.49,45.72 78.49,44.83 78.36,44.7 76.2,44.7 75.31,43.81 71.37,43.81 69.98,42.42 69.98,35.54 v69.99,35.53 | v65.91,20.57 v70.02,20.57
TDI  (via drill 0.6)
  Top 0.203: IC6.19 58.93,19.05 64.04,24.16 v64.04,27.32
  Bottom 0.203: J7.9 69.85,49.53 69.85,47.12 70.65,46.31 R34.P$1 67.69,44.96 65.66,42.93 65.66,41.53 63.37,39.24 63.37,34.54 64.04,33.88 v64.04,27.32
TDO  (via drill 0.6)
  Top 0.203: IC6.20 58.28,19.55 62.99,24.25 v62.99,30.15
  Bottom 0.203: J7.3 74.8,52.2 67.69,52.2 67.06,51.56 67.06,46.23 64.77,43.94 64.77,42.04 62.74,40.01 62.74,30.4 v62.99,30.15
TMS  (via drill 0.6)
  Top 0.203: IC6.16 54.97,17.55 54.23,18.29 52.32,18.29 51.18,19.43 51.18,24.64 v50.16,25.65 | J7.5 72.26,52.2 66.36,52.2 v66.06,51.9
  Bottom 0.203: v50.16,25.65 50.16,26.8 50.8,27.43 50.8,33.15 52.58,34.92 55.24,34.92 56.26,35.94 56.25,35.95 56.25,38.75 57.85,40.35 62.25,40.35 63.75,41.85 63.75,44.2 66.55,46.99 66.55,51.4 v66.06,51.9 | J7.5 72.39,49.53 72.39,46.52 R35.P$1
USB_DATA_N
  Top 0.203: J2.2 12.3,42.31 13.72,40.89 13.72,37.67 IC5.16
USB_DATA_P
  Top 0.203: IC5.15 13.05,40.29 11.68,41.66 9.1,41.66 arc90 8.74,41.3 8.74,41.06 arc-90 8.39,40.7 8.2,40.7 arc-90 7.84,41.06 7.84,41.3 arc90 7.49,41.66 J2.3
USBVCC  (via drill 0.6)
  Top 0.203: v16.26,35.56 16.3,35.6 IC5.20 16.3,39.96 15.37,40.89 14.48,40.89 12.2,43.18 F1.2 | PMOS1.2 PMOS1.1 PMOS1.5 8.8,26.95 v8.46,26.6 8.15,26.9 PMOS1.6 8.15,28.75 7.9,29 7.15,29 6.85,29.3 6.85,31.25 5.21,32.89 5.21,34.97 C9.+
  Top 0.406: F1.2 C10.1
  Bottom 0.406: v16.26,35.56 9.66,35.56 8.46,34.35 v8.46,26.6
VIN  (via drill 0.6)
  Top 0.254: J10.VIN 44.27,1.09 arc-45 44.09,1.02 16.89,1.02 16.33,1.58 arc-45 16.26,1.76 16.26,8.38 16.82,8.94 arc-45 17,9.02 20.14,9.02 v21.66,10.54
  Top 0.406: v21.66,10.54 21.6,10.6 21.6,13.55 19.8,15.35 D1.1 17.68,15.37 C1.+ | R7.P$2 13.36,35.09 15.2,33.25 17.55,33.25 18.8,32 21.72,32 22.86,30.86 22.85,30.85 22.85,27 27.18,22.67 27.18,21.21 23.87,17.9 C1.+ | IC1.3 12.26,21.65 16.01,17.9 C1.+

## Text on the board
tPlace: Microphone | PulseRain M10 | SPEAKER | 5V | 3.3V
bPlace: PulseRain M10 | V1.11 | PulseRain | Technology